# Altium project beacon1.PrjPCB
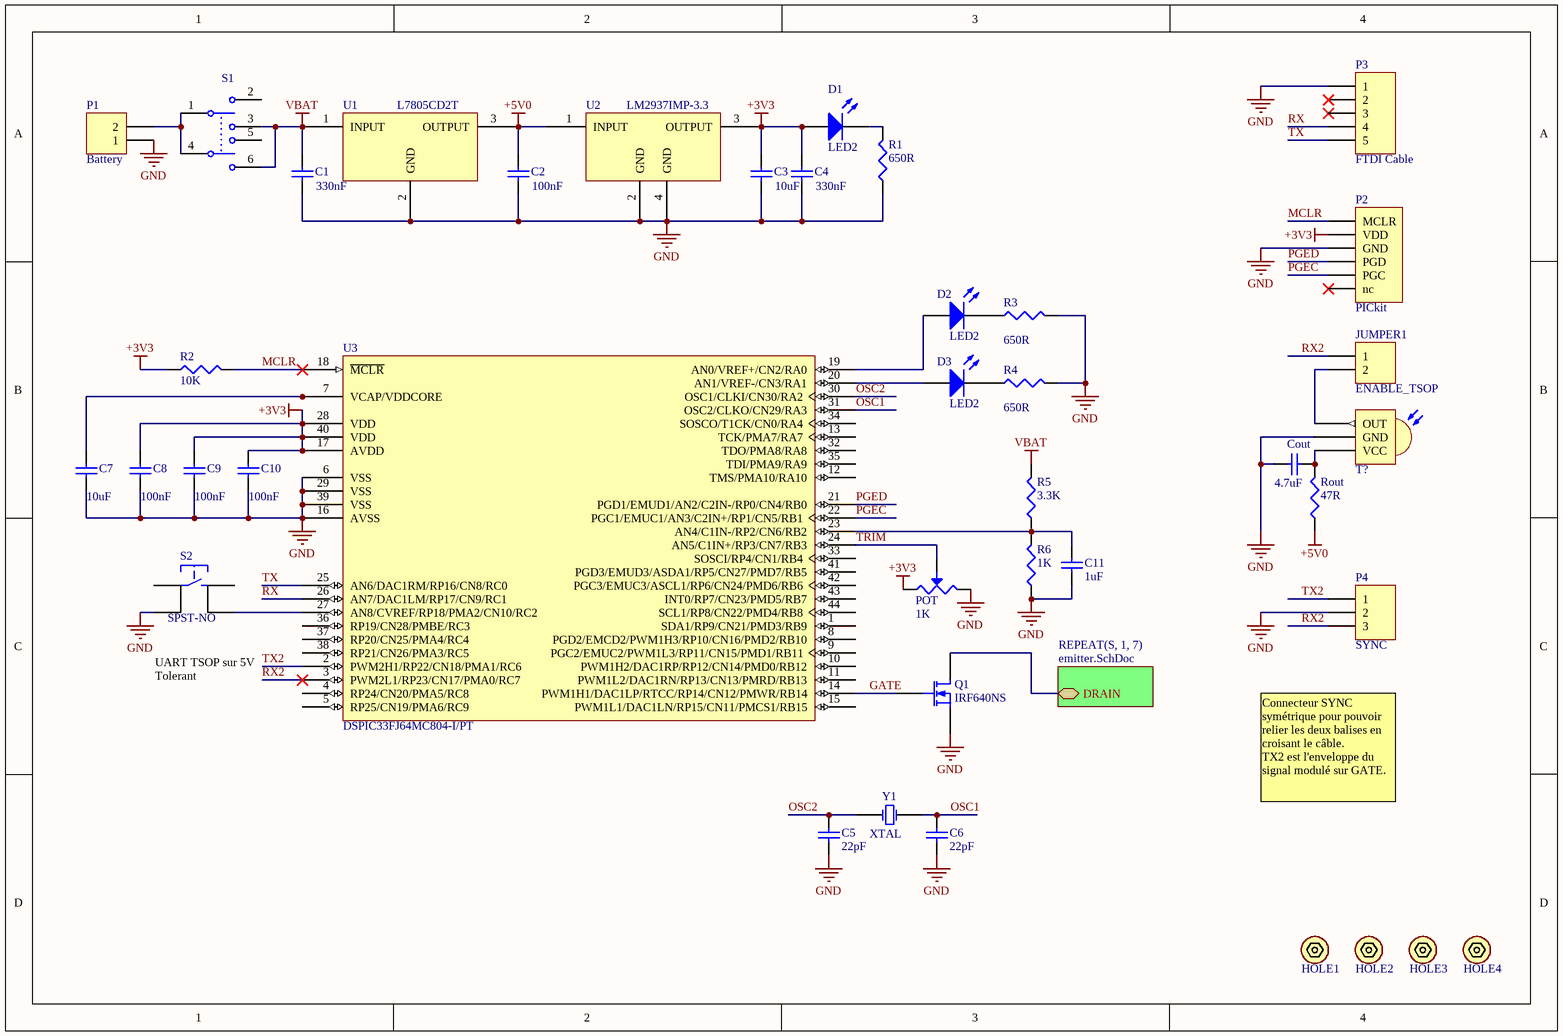
[diagram p0: beacon1.SchDoc]
2 sheets, 75 parts. Net scope: hierarchical (ports join the sheet entries above them; power ports are global).
Board file: Beacon.PcbDoc
Sheets:
  beacon1.SchDoc
    S1 = emitter.SchDoc
    S2 = emitter.SchDoc
    S3 = emitter.SchDoc
    S4 = emitter.SchDoc
    S5 = emitter.SchDoc
    S6 = emitter.SchDoc
    S7 = emitter.SchDoc

## Sheet beacon1.SchDoc
size A4

### Parts
C1  value 330nF  [C0805C]
C2  value 100nF  [C0805C]
C3  value 10uF  [C0805C]
C4  value 330nF  [C0805C]
C5  value 22pF  [C0805C]  (hidden comment: CAP)
C6  value 22pF  [C0805C]  (hidden comment: CAP)
C7  value 10uF  [C0805C]
C8  value 100nF  [C0805C]
C9  value 100nF  [C0805C]
C10  value 100nF  [C0805C]
C11  value 1uF  [C0805C]  (hidden comment: CAP)
Cout  value 4.7uF  [C0805C]  (hidden comment: CAP)
D1  LED2  [LED1206G]
D2  LED2  [LED1206R]
D3  LED2  [LED1206R]
HOLE1  Hole  [SCREW]  (value not drawn)
HOLE2  Hole  [SCREW]  (value not drawn)
HOLE3  Hole  [SCREW]  (value not drawn)
HOLE4  Hole  [SCREW]  (value not drawn)
JUMPER1  ENABLE_TSOP  [HDR1X2J]
P1  Battery  [HDR1X2H]
P2  PICkit  [HDR1X6H]
P3  FTDI Cable  [HDR1X5H]
P4  SYNC  [HDR1X3H]
POT  1K  [VR5 POT]
Q1  IRF640NS  [D2PAK]
R1  value 650R  [C0805R]
R2  value 10K  [C0805R]
R3  value 650R  [C0805R]
R4  value 650R  [C0805R]
R5  value 3.3K  [C0805R]  (hidden comment: RES)
R6  value 1K  [C0805R]  (hidden comment: RES)
Rout  value 47R  [C0805R]  (hidden comment: RES)
S1  SW-DPDT/Reset  [MCLSS22]  (value not drawn)
S2  SPST-NO  [SPST-NO]
T?  TSOP7000  [TSOP IR]  (value not drawn)
U1  L7805CD2T  [D2PAK]
U2  LM2937IMP-3.3  [SOT223]
U3  DSPIC33FJ64MC804-I/PT  [TQFP-PT44_N]
Y1  XTAL  [HC49SMD C]

### Sub-sheets
REPEAT(S, 1, 7) = emitter.SchDoc: DRAIN

### Nets
+3V3: C3.1 C4.1 C8.1 C9.1 C10.1 D1.1(A) P2.2(VDD) POT.1 R2.1 U2.3(OUTPUT) U3.17(AVDD) U3.28(VDD) U3.40(VDD)
+5V0: C2.1 Rout.1 U1.3(OUTPUT) U2.1(INPUT)
GND: C1.2 C2.2 C3.2 C4.2 C5.1 C6.1 C7.2 C8.2 C9.2 C10.2 C11.1 Cout.2 P1.1 P2.3(GND) P3.1 P4.2 POT.3 Q1.3(S) R1.1 R3.2 R4.2 R6.1 S2.2 T?.2(GND) U1.2(GND) U2.2(GND) U2.4(GND) U3.6(VSS) U3.16(AVSS) U3.29(VSS) U3.39(VSS)
VBAT: C1.1 R5.2 S1.3 S1.6 U1.1(INPUT)
GATE: Q1.1(G) U3.14(PWM1H1/DAC1LP/RTCC/RP14/CN12/PMWR/RB14)
MCLR: P2.1(MCLR) R2.2 U3.18(~{MCLR})
OSC1: C6.2 U3.31(OSC2/CLKO/CN29/RA3) Y1.2(OSC2)
OSC2: C5.2 U3.30(OSC1/CLKI/CN30/RA2) Y1.1(OSC1)
PGEC: P2.5(PGC) U3.22(PGC1/EMUC1/AN3/C2IN+/RP1/CN5/RB1)
PGED: P2.4(PGD) U3.21(PGD1/EMUD1/AN2/C2IN-/RP0/CN4/RB0)
RX: P3.4 U3.26(AN7/DAC1LM/RP17/CN9/RC1)
RX2: JUMPER1.1 P4.3 U3.3(PWM2L1/RP23/CN17/PMA0/RC7)
TRIM: POT.2 U3.24(AN5/C1IN+/RP3/CN7/RB3)
TX: P3.5 U3.25(AN6/DAC1RM/RP16/CN8/RC0)
TX2: P4.1 U3.2(PWM2H1/RP22/CN18/PMA1/RC6)
NetC7_1: C7.1 U3.7(VCAP/VDDCORE)
NetC11_2: C11.2 R5.1 R6.2 U3.23(AN4/C1IN-/RP2/CN6/RB2)
NetCout_1: Cout.1 Rout.2 T?.3(VCC)
NetD1_2: D1.2(K) R1.2
NetD2_1: D2.1(A) U3.19(AN0/VREF+/CN2/RA0)
NetD2_2: D2.2(K) R3.1
NetD3_1: D3.1(A) U3.20(AN1/VREF-/CN3/RA1)
NetD3_2: D3.2(K) R4.1
NetJUMPER1_2: JUMPER1.2 T?.1(OUT)
NetP1_2: P1.2 S1.1 S1.4
NetQ1_2: Q1.2(D) ; sheet REPEAT(S, 1, 7)/DRAIN
NetS2_3: S2.3 U3.27(AN8/CVREF/RP18/PMA2/CN10/RC2)

Not connected (* = marked no-connect by the designer): HOLE1 1(Hole); HOLE2 1(Hole); HOLE3 1(Hole); HOLE4 1(Hole); P2 6(nc)*; P3 2* 3*; S1 2 5; S2 1 4; U3 1(SDA1/RP9/CN21/PMD3/RB9) 4(RP24/CN20/PMA5/RC8) 5(RP25/CN19/PMA6/RC9) 8(PGD2/EMCD2/PWM1H3/RP10/CN16/PMD2/RB10) 9(PGC2/EMUC2/PWM1L3/RP11/CN15/PMD1/RB11) 10(PWM1H2/DAC1RP/RP12/CN14/PMD0/RB12) 11(PWM1L2/DAC1RN/RP13/CN13/PMRD/RB13) 12(TMS/PMA10/RA10) 13(TCK/PMA7/RA7) 15(PWM1L1/DAC1LN/RP15/CN11/PMCS1/RB15) 32(TDO/PMA8/RA8) 33(SOSCI/RP4/CN1/RB4) 34(SOSCO/T1CK/CN0/RA4) 35(TDI/PMA9/RA9) 36(RP19/CN28/PMBE/RC3) 37(RP20/CN25/PMA4/RC4) 38(RP21/CN26/PMA3/RC5) 41(PGD3/EMUD3/ASDA1/RP5/CN27/PMD7/RB5) 42(PGC3/EMUC3/ASCL1/RP6/CN24/PMD6/RB6) 43(INT0/RP7/CN23/PMD5/RB7) 44(SCL1/RP8/CN22/PMD4/RB8)

### Notes on the sheet
- (near S2) UART TSOP sur 5V Tolerant
- Connecteur SYNC symétrique pour pouvoir relier les deux balises en croisant le câble.
  TX2 est l'enveloppe du signal modulé sur GATE.

### Library data of the parts
C1-C4 C7-C10 = Cap Semi: Capacitor (Semiconductor SIM Model); Published: 8-Jun-2000; LatestRevisionDate: 29-May-2009; LatestRevisionNote: IPC-7351 Footprint Added.; PackageReference: C1206; Publisher: Altium Limited; PackageDescription: Chip Capacitor
C5 C6 C11 Cout = CAP: Capacitor; Published: 8-Jun-2000; LatestRevisionDate: 29-May-2009; LatestRevisionNote: IPC-7351 Footprint Added.; PackageReference: C1206; Publisher: Altium Limited; PackageDescription: Chip Capacitor
D1-D3 = LED2: Typical RED, GREEN, YELLOW, AMBER GaAs LED; Published: 8-Jun-2000; LatestRevisionDate: 17-Jul-2002; LatestRevisionNote: Re-released for DXP Platform.; PackageVersion: Feb-2002; PackageReference: 3.2X1.6X1.1; Publisher: Altium Limited; PackageDescription: SM LED; 2 Flat Leads
HOLE1-HOLE4 = Hole: Mounting Hole for screws
JUMPER1 P1 = Header 2: Header, 2-Pin; LatestRevisionDate: 17-Jul-2002; LatestRevisionNote: Re-released for DXP Platform.; Publisher: Altium Limited
P2 = Header ICSP: Header, 6-Pin, Right Angle; LatestRevisionDate: 17-Jul-2002; LatestRevisionNote: Re-released for DXP Platform.; Publisher: Altium Limited
P3 = Header 5: Header, 5-Pin; LatestRevisionDate: 17-Jul-2002; LatestRevisionNote: Re-released for DXP Platform.; Publisher: Altium Limited
P4 = Header 3: Header, 3-Pin; LatestRevisionDate: 17-Jul-2002; LatestRevisionNote: Re-released for DXP Platform.; Publisher: Altium Limited
POT = POT: Potentiometer
Q1 = IRF640: N-Channel MOSFET, D2PAK (T0-263), InternationalRectifier; Published: 8-Jun-2000; LatestRevisionDate: 17-Jul-2002; LatestRevisionNote: Re-released for DXP Platform.; PackageVersion: 1995/1996; PackageReference: E3; Publisher: Altium Limited; PackageDescription: TO, Flat Index; 3 In-Line, Axial Leads; Body Dia. 4.6mm; Lead Dia. 0.5 mm (max)
R1-R4 = Res3: Resistor; Published: 8-Jun-2000; LatestRevisionDate: 29-May-2009; LatestRevisionNote: IPC-7351 Footprint Added.; PackageReference: J1-0603; Publisher: Altium Limited; PackageDescription: Chip Resistor
R5 R6 Rout = RES: Resistor; Published: 8-Jun-2000; LatestRevisionDate: 29-May-2009; LatestRevisionNote: IPC-7351 Footprint Added.; PackageReference: J1-0603; Publisher: Altium Limited; PackageDescription: Chip Resistor
S1 = SW-DPDT: Double-Pole, Double-Throw Switch; Published: 24-Mar-1999; LatestRevisionDate: 17-Jul-2002; LatestRevisionNote: Re-released for DXP Platform.; PackageReference: DPDT-6; Publisher: Altium Limited; PackageDescription: Switch; 6 Leads
S2 = SPST-NO: Tactile Switch 7.3mm, SMD
T? = TSOP7000: Vishay 455kHz IR Receiver
U1 = L7805CD2T: 5V Linear Regulator, D2PAK, ST Microelectronics
U2 = LM2937IMP-3.3: 500 mA Low Dropout Regulator
U3 = DSPIC33FJ64MC804-I/PT: High-Performance 16-bit Digital Signal Controller, 64 KB Flash, 16 KB RAM, 44-Pin TQFP, Industrial Temperature; Published: 2-Dec-2009; DatasheetVersion: revD, Nov-2009; PackageVersion: revBB, Aug-2009; PackageReference: TQFP-PT44; Publisher: Altium Limited; PackageDescription: 44-Lead Plastic Thin Quad Flatpack (PT) - 10x10x1mm Body, 2.00mm [TQFP]; Supplier 1: Digi-Key; Supplier Part Number 1: DSPIC33FJ64MC804-I/PT-ND; Supplier 2: Farnell; Supplier Part Number 2: 1576844; Code_JEDEC: MS-026; ComponentLink1Description: Datasheet; ComponentLink1URL: http://ww1.microchip.com/downloads/en/DeviceDoc/70291D.pdf; ComponentLink2Description: Packaging Specification; ComponentLink2URL: http://www.microchip.com/stellent/groups/techpub_sg/documents/packagingspec/en012702.pdf; ComponentLink3Description: Microchip.com Home; ComponentLink3URL: http://www.microchip.com/
Y1 = XTAL: Crystal Oscillator; Published: 8-Jun-2000; LatestRevisionDate: 17-Jul-2002; LatestRevisionNote: Re-released for DXP Platform.; PackageReference: R38; Publisher: Altium Limited; PackageDescription: Crystal, Thru-Hole; 2 Leads; Body 3.1 x 8.2 mm (Dia.xH)

## Sheet emitter.SchDoc
size A4
Used 7 times, as channels S1, S2, S3, S4, S5, S6, S7. Parts and nets are listed once, with the designators drawn on the sheet.
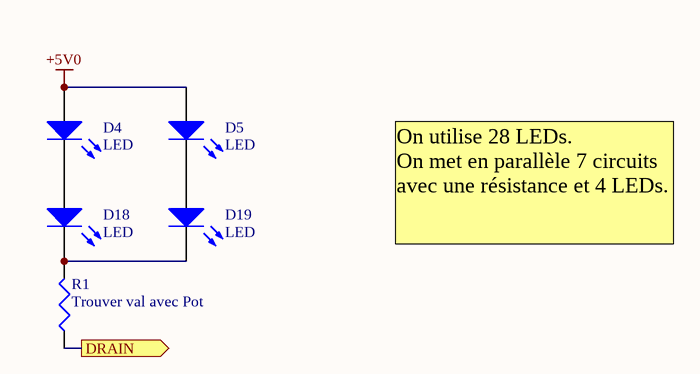
[diagram p1: emitter.SchDoc]

### Parts
D4  LED  [LED 5MM Horiz]
D5  LED  [LED 5MM Horiz]
D18  LED  [LED 5MM Horiz]
D19  LED  [LED 5MM Horiz]
R1  value Trouver val avec Pot  [AXIAL0.8 Vert]  (hidden comment: RES)

### Ports
DRAIN (out)

### Nets
+5V0: D4.A D5.A
DRAIN: R1.1 ; port DRAIN
NetD4_K: D4.K D18.A
NetD5_K: D5.K D19.A
NetD18_K: D18.K D19.K R1.2

### Channels
S1: designators end in _S1; ports DRAIN=NetQ1_2
S2: designators end in _S2; ports DRAIN=NetQ1_2
S3: designators end in _S3; ports DRAIN=NetQ1_2
S4: designators end in _S4; ports DRAIN=NetQ1_2
S5: designators end in _S5; ports DRAIN=NetQ1_2
S6: designators end in _S6; ports DRAIN=NetQ1_2
S7: designators end in _S7; ports DRAIN=NetQ1_2

### Notes on the sheet
- On utilise 28 LEDs.
  On met en parallèle 7 circuits avec une résistance et 4 LEDs.

### Library data of the parts
D4 D5 D18 D19 = LED: Typical RED, GREEN, YELLOW, AMBER GaAs LED; Published: 8-Jun-2000; LatestRevisionDate: 17-Jul-2002; LatestRevisionNote: Re-released for DXP Platform.; PackageVersion: Feb-2002; PackageReference: 3.2X1.6X1.1; Publisher: Altium Limited; PackageDescription: SM LED; 2 Flat Leads
R1 = RES: Resistor; Published: 8-Jun-2000; LatestRevisionDate: 29-May-2009; LatestRevisionNote: IPC-7351 Footprint Added.; PackageReference: J1-0603; Publisher: Altium Limited; PackageDescription: Chip Resistor

## Nets that join several sheets
+5V0: beacon1 (C2.1 Rout.1 U1.3 U2.1), S1 (D4_S1.A D5_S1.A), S2 (D4_S2.A D5_S2.A), S3 (D4_S3.A D5_S3.A), S4 (D4_S4.A D5_S4.A), S5 (D4_S5.A D5_S5.A), S6 (D4_S6.A D5_S6.A), S7 (D4_S7.A D5_S7.A)
NetQ1_2: beacon1 (Q1.2), S1 (R1_S1.1), S2 (R1_S2.1), S3 (R1_S3.1), S4 (R1_S4.1), S5 (R1_S5.1), S6 (R1_S6.1), S7 (R1_S7.1)